# EAGLE design Astron (EAGLE 8.5.1)
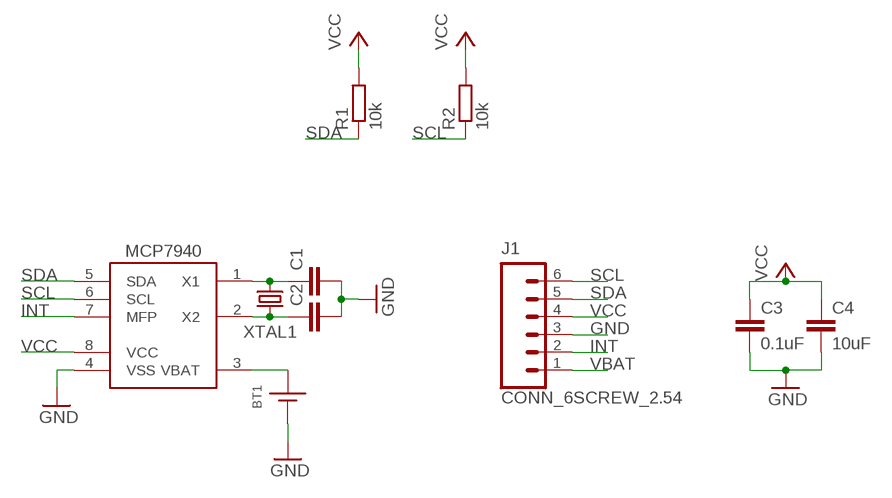
[diagram p0: schematic, sheet 1]

## Parts
BT1  BATTERY_COIN12MM  [LINX_BAT-HLD-012-SMT]
C1  C-EUC0603  [C0603]
C2  C-EUC0603  [C0603]
C3  0.1uF  C-EU0.1UFC0603  [C0603]
C4  10uF  C-EU10UFC0805  [C0805]
J1  CONN_6SCREW_2.54  [1X06_SCREW]
R1  10k  R-EU_R0603  [R0603]
R2  10k  R-EU_R0603  [R0603]
U$1  MCP7940SOIC  [SO08]
XTAL1  CRYSTAL3.2X1.5  [CRYSTAL_3.2X1.5_2-SMD]

## Nets
GND: BT1.GND(-) C1.2 C2.2 C3.2 C4.2 J1.3 U$1.4(VSS)
INT: J1.2 U$1.7(MFP)
N$1: C1.1 U$1.1(X1) XTAL1.P$1
N$2: C2.1 U$1.2(X2) XTAL1.P$2
SCL: J1.6 R2.1 U$1.6(SCL)
SDA: J1.5 R1.1 U$1.5(SDA)
VBAT: BT1.POWER0(+) BT1.POWER1(+) J1.1 U$1.3(VBAT)
VCC: C3.1 C4.1 J1.4 R1.2 R2.2 U$1.8(VCC)

## Library data of the parts
BT1 = bschulz:BATTERY_COIN: Coin Cell Battery Holder; DIGIKEY: BAT-HLD-012-SMT-ND; MF: Linx; MPN: BAT-HLD-012-SMT
C1 C2 = bschulz_passives:C-EU: CAPACITOR, European symbol
C3 = bschulz_passives:C-EU: CAPACITOR, European symbol; DIGIKEY: 490-6051-1-ND; MF: Murata; MPN: GCM188R71E104KA57D
C4 = bschulz_passives:C-EU: CAPACITOR, European symbol; DIGIKEY: 490-6473-6-ND; MF: Murata; MPN: GRM21BR61C106KE15K
J1 = bschulz:CONN_6: Genaric 6 pin header; DIGIKEY: ED10565-ND; MF: OnShore; MPN: OSTVN06A150
R1 R2 = bschulz_passives:R-EU_: RESISTOR, European symbol; MF: Yageo
U$1 = bschulz:MCP7940: MCP7940 - RTC Characteristics: VCC: 1.8~5.5V VBat: 1.3~5.5V Memory: 64B Interface: I2C Operating Temperature: -40°C to 85°C Digikey: MCP7940N-I/SN-ND <https://www.digikey.com/scripts/DkSearch/dksus.dll?Detail&itemSeq=257151033&uq=636590618847128166> Pin Compatible Alternatives <https://www.digikey.com/products/en/integrated-circuits-ics/clock-timing-real-time-clocks/690?FV=401994%2C26802e4%2C45003ef%2C450041e%2C4500072%2C450050c%2C4500565%2C450057c%2C450057e%2C4500010%2C4500011%2C4500017%2C450017d%2C4500180%2C450004f%2C1f140000%2Cffe002b2%2C16980015%2C1698001a%2C1698001d%2C16980026%2C16980027%2C16980029%2C16980036%2C16980009&quantity=10&ColumnSort=1000011&page=2&stock=1&nstock=1&pageSize=25> Note: These are recomendations at the time, always verify pin compatability using combination of Mrk1 EyeBall and quality datasheet; DIGIKEY: MCP7940N-I/SN-ND; MF: Microchip; MPN: MCP7940N-I/SN
XTAL1 = bschulz:CRYSTAL: Crystal Oscilator 2 Pin quartz crystal oscilators Variants 3.2x1.5mm (Only available in 32.768kHz) <https://www.digikey.com/products/en/crystals-oscillators-resonators/crystals/171?FV=b839bf%2Cb83a33%2C8640001%2C864000f%2C8640003%2C1f140000%2Cmu32.768kHz%7C2150%2Cffe000ab&quantity=10&ColumnSort=1000011&page=1&stock=1&k=crystal&pageSize=25&pkeyword=crystal> 5 x 3.2mm (8MHz ~ 50MHz) <https://www.digikey.com/products/en/crystals-oscillators-resonators/crystals/171?FV=402f3e%2Cb8434d%2C1f140000%2Cffe000ab&quantity=10&ColumnSort=1000011&page=1&stock=1&pageSize=25>

## Board
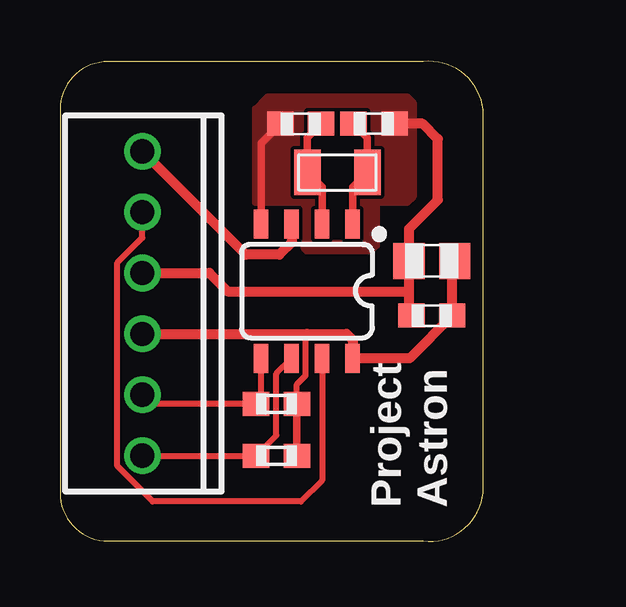
[diagram p1: board, top side]
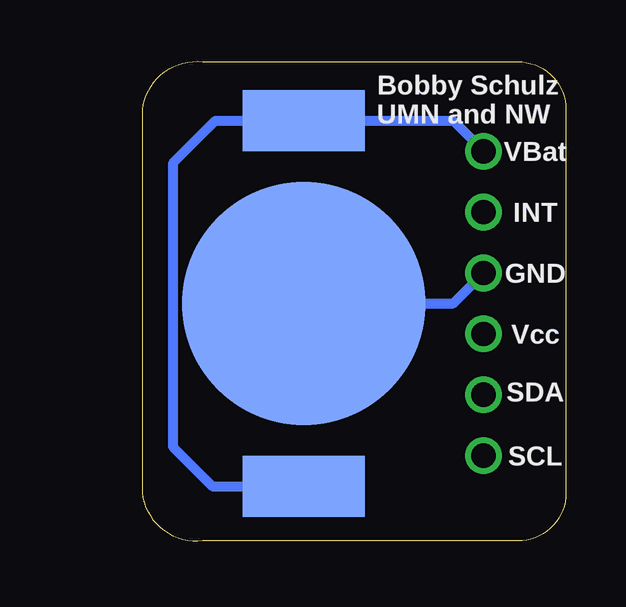
[diagram p2: board, bottom side, seen from below]

Size 17.63 x 20.02 mm. Coordinates in mm from the lower left corner, seen from the top.
Outline: 0,18 0,2.01 arc90 2,0.01 15.12,0.01 arc90 17.63,2.01 17.63,18 arc90 15.12,20 2,20 arc90 0,18
Copper layers (1*16): Top 0.035559375mm / dielectric 1.6mm / Bottom 0.035559375mm
Design rules "oshpark-2layer": minimum track width 6mil, minimum drill 10mil, track to track 6mil, track to pad 6mil, pad to pad 6mil, via to via 6mil, smd to smd 6mil, copper to edge 15mil, drill to drill 6mil, minimum pad ring 5mil, minimum via ring 5mil, stop-mask expansion 2.5mil, vias tented up to drill 0mil, thermal gap 10mil

### Footprints (pad centres in the part's own frame; a part is rotated, then mirrored left to right if it is on the bottom)
LINX_BAT-HLD-012-SMT = smd 10.16 x 10.16: GND 0,0 | smd 2.54 x 5.08: POWER0 -7.62,0; POWER1 7.62,0
C0603 = smd 1.1 x 1: 1 -0.85,0; 2 0.85,0
C0805 = smd 1.3 x 1.5: 1 -0.95,0; 2 0.95,0
1X06_SCREW = drill 1.016: 1 -6.35,0; 2 -3.81,0; 3 -1.27,0; 4 1.27,0; 5 3.81,0; 6 6.35,0
R0603 = smd 1.1 x 1: 1 -0.85,0; 2 0.85,0
SO08 = smd 0.6 x 1.2: 1 -1.905,-2.8; 2 -0.635,-2.8; 3 0.635,-2.8; 4 1.905,-2.8; 5 1.905,2.8; 6 0.635,2.8; 7 -0.635,2.8; 8 -1.905,2.8
CRYSTAL_3.2X1.5_2-SMD = smd 1.1 x 1.9: P$1 -1.25,0; P$2 1.25,0

### Placement (x,y rotation side)
BT1  10.92,9.92 270 bottom
C1  13.08,17.41 0 top
C2  10.03,17.41 180 top
C3  15.49,9.41 180 top
C4  15.49,11.7 180 top
J1  3.43,9.92 270 top
R1  9.02,5.73 0 top
R2  9.02,3.57 0 top
U$1  10.29,10.43 180 top
XTAL1  11.56,15.38 180 top

### Tracks (layer width: path | path; a pad name or v marks a point on that pad's centre or on a via)
GND
  Top 0.305: U$1.4 8.38,16.61 C2.2
  Top 0.406: C3.2 14.54,9.51 14.54,10.43 | 14.54,10.43 C4.2 14.54,13.03 15.75,14.24 15.75,16.78 15.11,17.41 C1.2 | J1.3 6.22,11.19 6.99,10.43 14.54,10.43
  Bottom 0.406: BT1.GND 4.7,9.92 J1.3
  pour Top (no thermals): 14.73,18.3 14.73,14.36 14.48,14.11 8.13,14.11 8.13,18.05 8.64,18.56 14.48,18.56
  pour Top: 13.21,14.11 13.21,12.33 12.95,12.08 10.29,12.08 10.16,12.21 10.16,14.11 10.54,14.11 10.54,12.59 10.67,12.46 12.57,12.46 12.57,14.11
INT
  Top 0.254: U$1.7 10.92,2.55 10.03,1.66 3.86,1.66 2.39,3.14 2.39,11.62 3.43,12.66 J1.2
N$1
  Top 0.305: U$1.1 12.19,14.77 XTAL1.P$1 12.81,16.84 C1.1
N$2
  Top 0.305: U$1.2 10.92,14.77 XTAL1.P$2 10.31,16.84 C2.1
SCL
  Top 0.254: J1.6 R2.1 9.02,4.42 9.02,6.99 U$1.6
SDA
  Top 0.254: U$1.5 8.38,5.94 R1.1 3.81,5.73 J1.5
VBAT
  Top 0.406: U$1.3 9.65,12.46 9.14,11.95 7.75,11.95 J1.1
  Bottom 0.406: BT1.POWER1 14.73,2.3 16.36,3.93 16.36,15.79 14.61,17.54 BT1.POWER0 4.7,17.54 J1.1
VCC
  Top 0.254: R1.2 9.87,6.55 10.23,6.91 10.23,8.59 10.29,8.65
  Top 0.305: R1.2 R2.2
  Top 0.406: C4.1 16.34,11.6 C3.1 14.57,7.63 U$1.8 | U$1.8 | J1.4 10.29,8.65 11.94,8.65 12.2,8.39 U$1.8

### Text on the board
tPlace: Project / Astron
bPlace: Bobby Schulz / UMN and NW | VBat | INT | GND | Vcc | SDA | SCL